# Altium project Powermessurment.PrjPcb
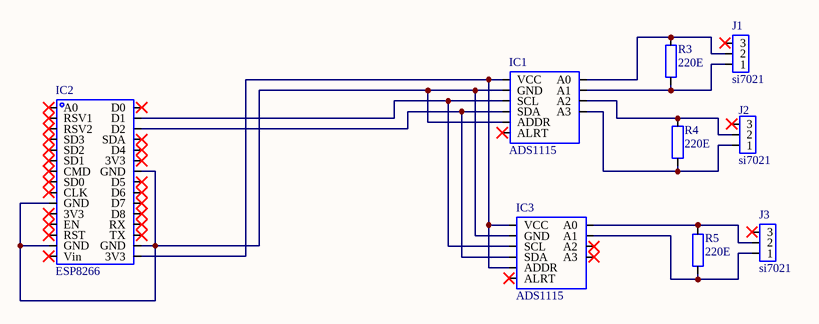
[diagram p0: Powermessurment SCH.schdoc]
1 sheet, 9 parts. Net scope: global (net labels, ports and power ports of the same name join across sheets).
Board file: Powermessurment PCB.PCBDOC

## Sheet Powermessurment SCH.schdoc: AT long bus (13.3 x 4.2 inches)
size A; Organization: Organization; Address1: Address1; Address2: Address2; Address3: Address3; Address4: Address4; DocumentNumber: 1; Revision: 0; SheetNumber: 2; SheetTotal: 2

### Parts
IC1  ADS1115  [ADS1115]
IC2  ESP8266  [ESP8266]
IC3  ADS1115  [ADS1115]
J1  si7021  [3,5mm Jack]
J2  si7021  [3,5mm Jack]
J3  si7021  [3,5mm Jack]
R3  220E  [220E]
R4  220E  [220E]
R5  220E  [220E]

### Nets
NetIC1_1: IC1.1(VCC) IC2.16(3V3) IC3.1(VCC) IC3.5(ADDR)
NetIC1_2: IC1.2(GND) IC1.5(ADDR) IC2.10(GND) IC2.14(GND) IC2.17(GND) IC2.24(GND) IC3.2(GND)
NetIC1_3: IC1.3(SCL) IC2.29(D1) IC3.3(SCL)
NetIC1_4: IC1.4(SDA) IC2.28(D2) IC3.4(SDA)
NetIC1_7: IC1.7(A0) J1.2 R3.2
NetIC1_8: IC1.8(A1) J1.1 R3.1
NetIC1_9: IC1.9(A2) J2.2 R4.2
NetIC1_10: IC1.10(A3) J2.1 R4.1
NetIC3_7: IC3.7(A0) J3.2 R5.2
NetIC3_8: IC3.8(A1) J3.1 R5.1

Not connected (* = marked no-connect by the designer): IC1 6(ALRT)*; IC2 1(A0)* 2(RSV1)* 3(RSV2)* 4(SD3)* 5(SD2)* 6(SD1)* 7(CMD)* 8(SD0)* 9(CLK)* 11(3V3)* 12(EN)* 13(RST)* 15(Vin)* 18(TX)* 19(RX)* 20(D8)* 21(D7)* 22(D6)* 23(D5)* 25(3V3)* 26(D4)* 27(SDA)* 30(D0)*; IC3 6(ALRT)* 9(A2)* 10(A3)*; J1 3*; J2 3*; J3 3*

### Library data of the parts
J1-J3 = 3,5mm Jack